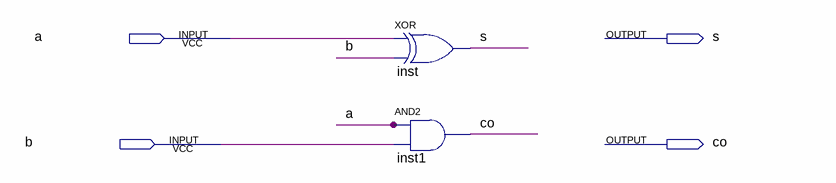
[diagram p0: schematic sheet]
// Quartus schematic jpd_ha.bdf as structural Verilog: 2 symbols, 4 pins
module jpd_ha (
  input  a,
  input  b,
  output s,
  output co
);

  xor inst (s, a, b);
  and inst1 (co, a, b);
endmodule
